# Altium schematic sheet 5V_12V_Converter.SchDoc
size B; SheetNumber: 3; SheetTotal: 8
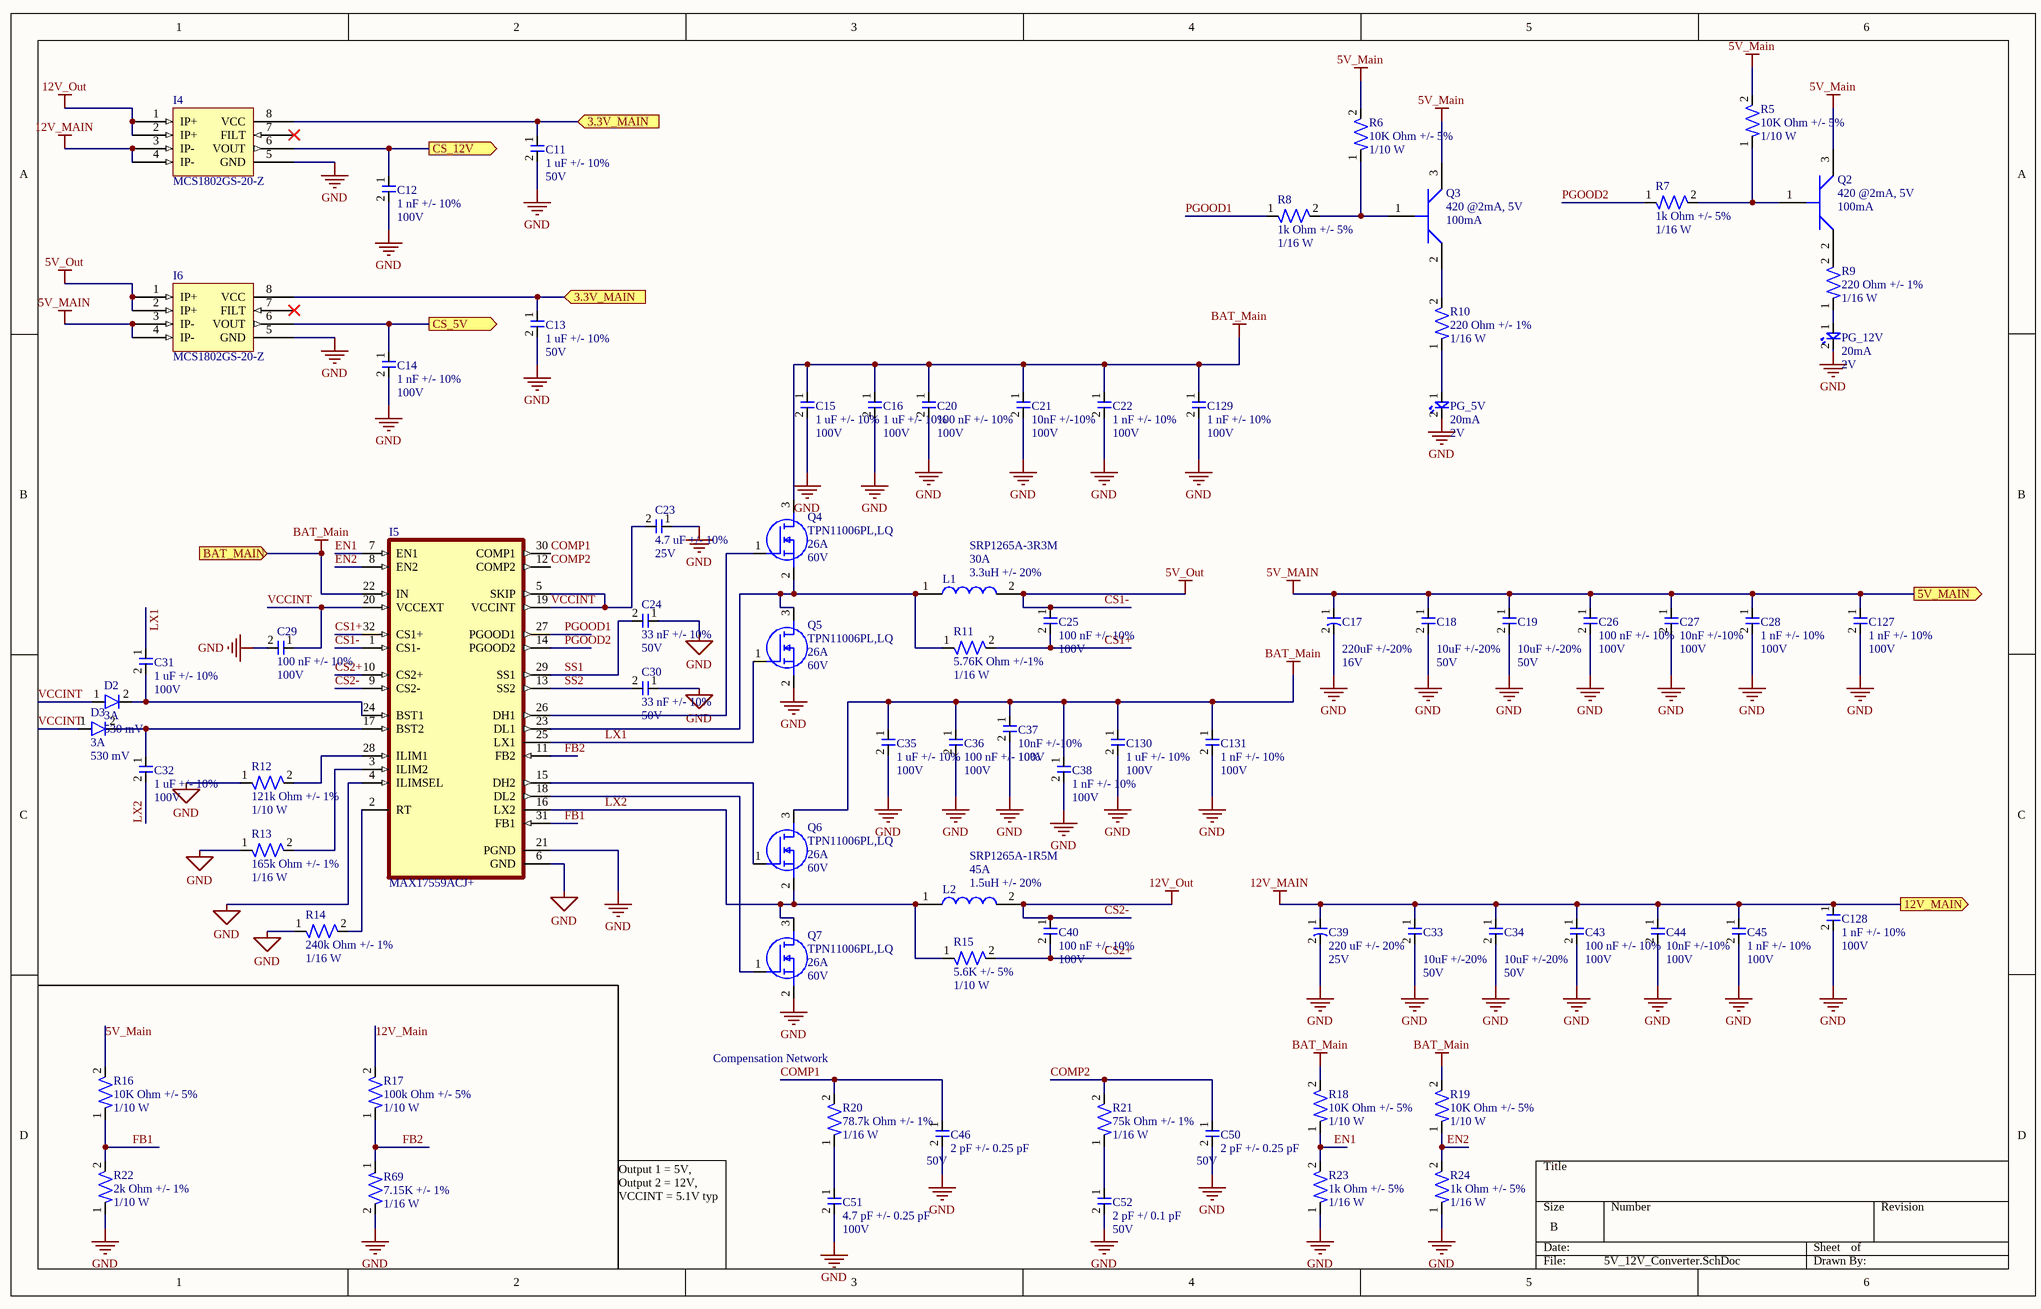
[diagram p0: 5V_12V_Converter.SchDoc]

## Parts
C11  Cap: 1 uF +/- 10%  Voltage: 50V  [CAP-0805]  (hidden comment: GCM21BR71H105KA03L)
C12  Capacitance: 1 nF +/- 10%  Voltage: 100V  [CAP-0402]  (hidden comment: C0402C102K1GECAUTO)
C13  Cap: 1 uF +/- 10%  Voltage: 50V  [CAP-0805]  (hidden comment: GCM21BR71H105KA03L)
C14  Capacitance: 1 nF +/- 10%  Voltage: 100V  [CAP-0402]  (hidden comment: C0402C102K1GECAUTO)
C15  Capacitance: 1 uF +/- 10%  Voltage: 100V  [CAP-1206 - duplicate]  (hidden comment: C1206X105K101T)
C16  Capacitance: 1 uF +/- 10%  Voltage: 100V  [CAP-1206 - duplicate]  (hidden comment: C1206X105K101T)
C17  Capacitance: 220uF +/-20%  Voltage Rating: 16V  [ELEC-220U-0001]  (hidden comment: UUD1C221MCL1GS)
C18  Capacitance: 10uF +/-20%  Voltage Rating: 50V  [CAP-1206]  (hidden comment: CL31B106KBHNNNE)
C19  Capacitance: 10uF +/-20%  Voltage Rating: 50V  [CAP-1206]  (hidden comment: CL31B106KBHNNNE)
C20  Capacitance: 100 nF +/- 10%  Voltage: 100V  [CAP-0603]  (hidden comment: CC0603KRX7R0BB104)
C21  Capacitance: 10nF +/-10%  Voltage Rating: 100V  [CAP-0603]  (hidden comment: CC0603KRX7R0BB103)
C22  Capacitance: 1 nF +/- 10%  Voltage: 100V  [CAP-0402]  (hidden comment: C0402C102K1GECAUTO)
C23  Capacitacen: 4.7 uF +/- 10%  Voltage: 25V  [CAP-0603]  (hidden comment: CC0603KRX5R8BB475)
C24  Capacitance: 33 nF +/- 10%  Voltage: 50V  [CAP-0402]  (hidden comment: GRM155R71H333KE14D)
C25  Capacitance: 100 nF +/- 10%  Voltage: 100V  [CAP-0603]  (hidden comment: CC0603KRX7R0BB104)
C26  Capacitance: 100 nF +/- 10%  Voltage: 100V  [CAP-0603]  (hidden comment: CC0603KRX7R0BB104)
C27  Capacitance: 10nF +/-10%  Voltage Rating: 100V  [CAP-0603]  (hidden comment: CC0603KRX7R0BB103)
C28  Capacitance: 1 nF +/- 10%  Voltage: 100V  [CAP-0402]  (hidden comment: C0402C102K1GECAUTO)
C29  Capacitance: 100 nF +/- 10%  Voltage: 100V  [CAP-0603]  (hidden comment: CC0603KRX7R0BB104)
C30  Capacitance: 33 nF +/- 10%  Voltage: 50V  [CAP-0402]  (hidden comment: GRM155R71H333KE14D)
C31  Capacitance: 1 uF +/- 10%  Voltage: 100V  [CAP-1206 - duplicate]  (hidden comment: CL31B105KCHNNNE)
C32  Capacitance: 1 uF +/- 10%  Voltage: 100V  [CAP-1206 - duplicate]  (hidden comment: CL31B105KCHNNNE)
C33  Capacitance: 10uF +/-20%  Voltage Rating: 50V  [CAP-1206]  (hidden comment: CL31B106KBHNNNE)
C34  Capacitance: 10uF +/-20%  Voltage Rating: 50V  [CAP-1206]  (hidden comment: CL31B106KBHNNNE)
C35  Capacitance: 1 uF +/- 10%  Voltage: 100V  [CAP-1206 - duplicate]  (hidden comment: C1206X105K101T)
C36  Capacitance: 100 nF +/- 10%  Voltage: 100V  [CAP-0603]  (hidden comment: CC0603KRX7R0BB104)
C37  Capacitance: 10nF +/-10%  Voltage Rating: 100V  [CAP-0603]  (hidden comment: CC0603KRX7R0BB103)
C38  Capacitance: 1 nF +/- 10%  Voltage: 100V  [CAP-0402]  (hidden comment: C0402C102K1GECAUTO)
C39  Capacitance: 220 uF +/- 20%  Voltage: 25V  [ELEC-220U-0002]  (hidden comment: 25THV220M8X10.5)
C40  Capacitance: 100 nF +/- 10%  Voltage: 100V  [CAP-0603]  (hidden comment: CC0603KRX7R0BB104)
C43  Capacitance: 100 nF +/- 10%  Voltage: 100V  [CAP-0603]  (hidden comment: CC0603KRX7R0BB104)
C44  Capacitance: 10nF +/-10%  Voltage Rating: 100V  [CAP-0603]  (hidden comment: CC0603KRX7R0BB103)
C45  Capacitance: 1 nF +/- 10%  Voltage: 100V  [CAP-0402]  (hidden comment: C0402C102K1GECAUTO)
C46  Cap: 2 pF +/- 0.25 pF  Voltage: 50V  [CAP-0402]  (hidden comment: GJM1555C1H2R0CB01D)
C50  Cap: 2 pF +/- 0.25 pF  Voltage: 50V  [CAP-0402]  (hidden comment: GJM1555C1H2R0CB01D)
C51  capacitance: 4.7 pF +/- 0.25 pF  Voltage: 100V  [CAP-0603]  (hidden comment: CC0603CRNPO0BN4R7)
C52  Capacitance: 2 pF +/ 0.1 pF  Voltage: 50V  [CAP-0402]  (hidden comment: CC0402BRNPO9BN3R0)
C127  Capacitance: 1 nF +/- 10%  Voltage: 100V  [CAP-0402]  (hidden comment: C0402C102K1GECAUTO)
C128  Capacitance: 1 nF +/- 10%  Voltage: 100V  [CAP-0402]  (hidden comment: C0402C102K1GECAUTO)
C129  Capacitance: 1 nF +/- 10%  Voltage: 100V  [CAP-0402]  (hidden comment: C0402C102K1GECAUTO)
C130  Capacitance: 1 uF +/- 10%  Voltage: 100V  [CAP-1206 - duplicate]  (hidden comment: C1206X105K101T)
C131  Capacitance: 1 nF +/- 10%  Voltage: 100V  [CAP-0402]  (hidden comment: C0402C102K1GECAUTO)
D2  Current Rating: 3A  Vf (Voltage Forward): 530 mV  [DIO-SOD128]  (hidden comment: PMEG6030EP,115)
D3  Current Rating: 3A  Vf (Voltage Forward): 530 mV  [DIO-SOD128]  (hidden comment: PMEG6030EP,115)
I4  MCS1802GS-20-Z  [IC-BUCK-8SOIC]
I5  MAX17559ACJ+  [IC-BUCK-TQFP-7x7]
I6  MCS1802GS-20-Z  [IC-BUCK-8SOIC]
L1  SRP1265A-3R3M  Saturation Current: 30A  Inductance: 3.3uH +/- 20%  [PWRIND-3.3U-0002]
L2  SRP1265A-1R5M  Saturation Current: 45A  Inductance: 1.5uH +/- 20%  [PWRIND-1.5U-0002]
PG_5V  Current Rating: 20mA  Vf: 2V  [LED-0603]  (hidden comment: 150060AS75000)
PG_12V  Current Rating: 20mA  Vf: 2V  [LED-0603]  (hidden comment: 150060AS75000)
Q2  hFE: 420 @2mA, 5V  Ic: 100mA  [NPN-420-0001]  (hidden comment: BC847C,235)
Q3  hFE: 420 @2mA, 5V  Ic: 100mA  [NPN-420-0001]  (hidden comment: BC847C,235)
Q4  TPN11006PL,LQ  Id-Continuous: 26A  VDS-Max: 60V  [NMOS-8TSON]
Q5  TPN11006PL,LQ  Id-Continuous: 26A  VDS-Max: 60V  [NMOS-8TSON]
Q6  TPN11006PL,LQ  Id-Continuous: 26A  VDS-Max: 60V  [NMOS-8TSON]
Q7  TPN11006PL,LQ  Id-Continuous: 26A  VDS-Max: 60V  [NMOS-8TSON]
R5  Resistance: 10K Ohm +/- 5%  Power: 1/10 W  [RES-0402]  (hidden comment: ERJ2GEJ103X)
R6  Resistance: 10K Ohm +/- 5%  Power: 1/10 W  [RES-0402]  (hidden comment: ERJ2GEJ103X)
R7  Resistance: 1k Ohm +/- 5%  Power: 1/16 W  [RES-0402]  (hidden comment: RC0402FR-071KL)
R8  Resistance: 1k Ohm +/- 5%  Power: 1/16 W  [RES-0402]  (hidden comment: RC0402FR-071KL)
R9  Resistance: 220 Ohm +/- 1%  Power: 1/16 W  [RES-0402]  (hidden comment: RM04FTN2200)
R10  Resistance: 220 Ohm +/- 1%  Power: 1/16 W  [RES-0402]  (hidden comment: RM04FTN2200)
R11  Resistance: 5.76K Ohm +/-1%  Power: 1/16 W  [RES-0402]  (hidden comment: RTT025761FTH)
R12  Resistance: 121k Ohm +/- 1%  Power: 1/10 W  [RES-0402]  (hidden comment: RMC10K1213FTH)
R13  Resistance: 165k Ohm +/- 1%  Power: 1/16 W  [RES-0402]  (hidden comment: RC0402FR-07165KL)
R14  Resistance: 240k Ohm +/- 1%  Power: 1/16 W  [RES-0402]  (hidden comment: 0402WGF2403TCE)
R15  Resistance: 5.6K +/- 5%  Power: 1/10 W  [RES-0402]  (hidden comment: ERJ2GEJ472X)
R16  Resistance: 10K Ohm +/- 5%  Power: 1/10 W  [RES-0402]  (hidden comment: ERJ2GEJ103X)
R17  Resistance: 100k Ohm +/- 5%  Power: 1/10 W  [RES-0402]  (hidden comment: ERJ2GEJ104X)
R18  Resistance: 10K Ohm +/- 5%  Power: 1/10 W  [RES-0402]  (hidden comment: ERJ2GEJ103X)
R19  Resistance: 10K Ohm +/- 5%  Power: 1/10 W  [RES-0402]  (hidden comment: ERJ2GEJ103X)
R20  Resistance: 78.7k Ohm +/- 1%  Power: 1/16 W  [RES-0402]  (hidden comment: RC0402FR-0778K7L)
R21  Resistance: 75k Ohm +/- 1%  Power: 1/16 W  [RES-0402]  (hidden comment: CR0402FF7502G)
R22  Resistance: 2k Ohm +/- 1%  Parameter 2: 1/10 W  [RES-0402]  (hidden comment: ERJ2RKF2001X)
R23  Resistance: 1k Ohm +/- 5%  Power: 1/16 W  [RES-0402]  (hidden comment: RC0402FR-071KL)
R24  Resistance: 1k Ohm +/- 5%  Power: 1/16 W  [RES-0402]  (hidden comment: RC0402FR-071KL)
R69  Resistance: 7.15K +/- 1%  Power: 1/16 W  [RES-0402]  (hidden comment: CRCW04027K15FKED)

## Ports
3.3V_MAIN (in), 5V_MAIN (out), 12V_MAIN (out), BAT_MAIN (in), CS_5V (out), CS_12V (out)

## Nets
5V_Main: C17.1 C18.1 C19.1 C26.1 C27.1 C28.1 C127.1 I6.3(IP-) I6.4(IP-) Q2.3 Q3.3 R5.2 R6.2 R16.2 ; port 5V_MAIN
12V_Main: C33.1 C34.1 C39.1 C43.1 C44.1 C45.1 C128.1 I4.3(IP-) I4.4(IP-) R17.2 ; port 12V_MAIN
BAT_Main: C15.1 C16.1 C20.1 C21.1 C22.1 C35.1 C36.1 C37.1 C38.1 C129.1 C130.1 C131.1 I5.22(IN) Q4.3(D) Q6.3(D) R18.2 R19.2 ; port BAT_MAIN
CS1-: C25.1 I5.1(CS1-) I6.1(IP+) I6.2(IP+) L1.2  [also labelled 5V_Out]
CS2-: C40.1 I4.1(IP+) I4.2(IP+) I5.9(CS2-) L2.2  [also labelled 12V_Out]
GND: C11.2 C12.2 C13.2 C14.2 C15.2 C16.2 C17.2 C18.2 C19.2 C20.2 C21.2 C22.2 C23.1 C24.1 C26.2 C27.2 C28.2 C29.2 C30.1 C33.2 C34.2 C35.2 C36.2 C37.2 C38.2 C39.2 C43.2 C44.2 C45.2 C46.2 C50.2 C51.2 C52.2 C127.2 C128.2 C129.2 C130.2 C131.2 I4.5(GND) I5.4(ILIMSEL) I5.6(GND) I5.21(PGND) I6.5(GND) PG_5V.2 PG_12V.2 Q5.2(S) Q7.2(S) R12.1 R13.1 R14.1 R22.1 R23.1 R24.1 R69.2
3.3V_MAIN: C11.1 C13.1 I4.8(VCC) I6.8(VCC) ; port 3.3V_MAIN
COMP1: C46.1 I5.30(COMP1) R20.2
COMP2: C50.1 I5.12(COMP2) R21.2
CS1+: C25.2 I5.32(CS1+) R11.2
CS2+: C40.2 I5.10(CS2+) R15.2
CS_5V: C14.1 I6.6(VOUT) ; port CS_5V
CS_12V: C12.1 I4.6(VOUT) ; port CS_12V
EN1: I5.7(EN1) R18.1 R23.2
EN2: I5.8(EN2) R19.1 R24.2
FB1: I5.31(FB1) R16.1 R22.2
FB2: I5.11(FB2) R17.1 R69.1
LX1: C31.1 I5.25(LX1) Q5.1(G)
LX2: C32.2 I5.16(LX2) L2.1 Q6.2(S) Q7.3(D) R15.1
PGOOD1: I5.27(PGOOD1) R8.1
PGOOD2: I5.14(PGOOD2) R7.1
SS1: C24.2 I5.29(SS1)
SS2: C30.2 I5.13(SS2)
VCCINT: C23.2 C29.1 D2.1 D3.1 I5.5(SKIP) I5.19(VCCINT) I5.20(VCCEXT)
NetC31_2: C31.2 D2.2 I5.24(BST1)
NetC32_1: C32.1 D3.2 I5.17(BST2)
NetC51_1: C51.1 R20.1
NetC52_1: C52.1 R21.1
NetI5_2: I5.2(RT) R14.2
NetI5_3: I5.3(ILIM2) R13.2
NetI5_15: I5.15(DH2) Q6.1(G)
NetI5_18: I5.18(DL2) Q7.1(G)
NetI5_23: I5.23(DL1) L1.1 Q4.2(S) Q5.3(D) R11.1
NetI5_26: I5.26(DH1) Q4.1(G)
NetI5_28: I5.28(ILIM1) R12.2
NetPG_5V_1: PG_5V.1 R10.1
NetPG_12V_1: PG_12V.1 R9.1
NetQ2_1: Q2.1 R5.1 R7.2
NetQ2_2: Q2.2 R9.2
NetQ3_1: Q3.1 R6.1 R8.2
NetQ3_2: Q3.2 R10.2

Not connected (* = marked no-connect by the designer): I4 7(FILT)*; I6 7(FILT)*

## Notes on the sheet
- (near R20) Compensation Network
- Output 1 = 5V,   Output 2 = 12V, VCCINT = 5.1V typ

## Library data of the parts
C11 C13 = CAP-1U-0003-JLC: 50V 1uF X7R ±10% 0805 Multilayer Ceramic Capacitors MLCC - SMD/SMT ROHS; assembled?: yes; JLC Part Number: C126592
C12 C14 C22 C28 C38 C45 C127-C129 C131 = CAP-1N-0004-JLC: 100V 1nF C0G ±10% 0402 Multilayer Ceramic Capacitors MLCC - SMD/SMT ROHS; assembled?: yes; JLC part number: C696348
C15 C16 C35 C130 = CAP-1U-0004-JLC: 100V 1uF X7R ±10% 1206 Multilayer Ceramic Capacitors MLCC - SMD/SMT ROHS; assembled: yes; JLC Part Number: C106026
C17 = ELEC-220U-0001: 220 µF 16 V Aluminum Electrolytic Capacitors Radial, Can - SMD 2000 Hrs @ 105°C; Manufacturer: Nichicon; Assembled?: no; Manufacturer Part Number: UUD1C221MCL1GS
C18 C19 C33 C34 = CAP-10U-0001: 10 µF ±10% 50V Ceramic Capacitor X7R 1206 (3216 Metric); Manufacturer: Samsung Electro-Mechanics; Assembled?: no; Manufacturer Part Number: CL31B106KBHNNNE; Temperature Coefficient: X7R; Package Size: 1206
C20 C25 C26 C29 C36 C40 C43 = CAP-100N-0002-JLC: 100V 100nF X7R ±10% 0603 Multilayer Ceramic Capacitors MLCC - SMD/SMT ROHS; assembled?: yes; JLC Part Number: C113803
C21 C27 C37 C44 = CAP-10N-0003-JLC: 100V 10nF X7R ±10% 0603 Multilayer Ceramic Capacitors MLCC - SMD/SMT ROHS; Manufacturer: Yageo; Assembled?: yes; Manufacturer Part Number: CC0603KRX7R0BB103; Temperature Coefficient: X7R; Package Size: 0603; JLC Part Number: C107059
C23 = CAP-4.7U-0002-JLC: 25V 4.7uF X5R ±10% 0603 Multilayer Ceramic Capacitors MLCC - SMD/SMT ROHS; assembled: yes; JLC part number: C326580
C24 C30 = CAP-33N-0002-JLC: 50V 33nF X7R ±10% 0402  Multilayer Ceramic Capacitors MLCC - SMD/SMT ROHS; assembled?: yes; JLC part number: C415530
C31 C32 = CAP-1U-0001: 1 µF ±10% 100V Ceramic Capacitor X7R 1206 (3216 Metric)
C39 = ELEC-220U-0002: 220 µF 25 V Aluminum Electrolytic Capacitors Radial, Can - SMD 300mOhm @ 100kHz 3000 Hrs @ 125°C; SIze: 0.327 in x 0.327 in
C46 C50 = CAP-2P-0002-JLC: 50V 2pF C0G ±0.25pF 0402 Multilayer Ceramic Capacitors MLCC - SMD/SMT ROHS; assembled: yes; JLC part number: C85879
C51 = CAP-4.7P-0003-JLC: 100V 4.7pF NP0 ±0.25pF 0603 Multilayer Ceramic Capacitors MLCC - SMD/SMT ROHS; assembled: yes; JLC part number: C527037
C52 = CAP-3P-0001-JLC: 50V 3pF NP0 ±0.1pF 0402 Multilayer Ceramic Capacitors MLCC - SMD/SMT ROHS; assembled: yes; JLC Part Number: C327228
D2 D3 = DIO-0.53V-0001: Diode Schottky 60 V 3A Surface Mount SOD-128/CFP5; Manufacturer: Nexperia USA Inc.; Assembled: no; Manufacturer Part Number: PMEG6030EP,115; Package: SOD-128/CFP5
I4 I6 = IC-CURRENT-0002: Current Sensor ±20A 1 Channel Hall Effect Bidirectional 8-SOIC (0.154", 3.90mm Width); Manufacturer Part Number: MCS1802GS-20-Z
I5 = IC-BUCK-0005: Buck Regulator Positive Output Step-Down - DC-DC Controller IC 32-TQFP (7x7); MF: Maxim Integrated; SnapEDA_Link: https://www.snapeda.com/parts/MAX17559ACJ+/Maxim+Integrated/view-part/?ref=snap; MP: MAX17559ACJ+; Package: TQFP-32 Maxim; Check_prices: https://www.snapeda.com/parts/MAX17559ACJ+/Maxim+Integrated/view-part/?ref=eda; Value: *; Purchase-URL: https://pricing.snapeda.com/search/part/MAX17559ACJ+/?ref=eda; Digi-Key_Part_Number: MAX17559ACJ+T-ND
L1 = PWRIND-3.3U-0002: 3.3 µH Shielded Drum Core, Wirewound Inductor 18 A 6.8mOhm Max Nonstandard; Manufacturer: Bourns Electronics; Type: DEV; Copyright: Copyright (C) 2022 Ultra Librarian. All rights reserved.; Manufacturer Part Number: SRP1265A-3R3M; Dimensions: 12.5x13.5x6.2; DC Resistance: 6.8mOhm max
L2 = PWRIND-1.5U-0002: 1.5 µH Shielded Drum Core, Wirewound Inductor 27 A 3mOhm Max Nonstandard; Manufacturer: Bourns Electronics; Type: DEV; DC Resistnace: 3.0mOhm max; Copyright: Copyright (C) 2022 Ultra Librarian. All rights reserved.; Manufacturer Part Number: SRP1265A-1R5M; Dimensions: 12.5x13.5x6.2
PG_5V PG_12V = LED_Amber_0001: CAP CER 0.1UF 100V X7R 0603; Manufacturer: Wurth Electronik; Assembled?: no; Manufacturer Part Number: 150060AS75000; Package Size: 0603; Color: Amber
Q2 Q3 = BJT-420-0001: Bipolar (BJT) Transistor NPN 45 V 100 mA 100MHz 250 mW Surface Mount TO-236AB; VCEO: 45V; Transistor type: NPN; Package: TO-236AB
Q4-Q7 = NMOS-26A-0001: N-Channel 60 V 26A (Tc) 610mW (Ta), 61W (Tc) Surface Mount 8-TSON Advance (3.1x3.1); Manufacturer: Toshiba; Rds On-Max: 18.1mOhm; Vgs-Max: 20V; Assembled?: no; Manufacturer Part Number: TPN11006PL,LQ; FET type: N-Channel; Package: 8-TSON Advance
R5 R6 R16 R18 R19 = RES-10K-0003-JLC: 100mW Thick Film Resistors 100V ±5% ±200ppm/℃ -55℃~+155℃ 10kΩ 0402  Chip Resistor - Surface Mount ROHS; assembled?: yes; JLC part number: C278577
R7 R8 R23 R24 = RES-1K-0003-JLC: 62.5mW Thick Film Resistors 50V ±100ppm/℃ ±1% -55℃~+155℃ 1kΩ 0402 Chip Resistor - Surface Mount ROHS; assembled?: yes; JLC Part Number: C106235
R9 R10 = RES-220-0002-JLC: 62.5mW Thick Film Resistors 50V ±100ppm/℃ ±1% -55℃~+155℃ 220Ω 0402  Chip Resistor - Surface Mount ROHS; assembled?: yes; JLC part number: C160487
R11 = RES-5.76K-0002-JLC: 62.5mW Thick Film Resistors 50V ±100ppm/℃ ±1% -55℃~+155℃ 5.76kΩ 0402  Chip Resistor - Surface Mount ROHS; assembled?: yes; JLC part number: C11590
R12 = RES-121K-0002-JLC: 100mW ±100ppm/℃ ±1% 121kΩ 0402  Chip Resistor - Surface Mount ROHS; assembled?: yes; JLC part number: C323687
R13 = RES-165K-0002-JLC: 62.5mW Thick Film Resistors 50V ±100ppm/℃ ±1% -55℃~+155℃ 165kΩ 0402  Chip Resistor - Surface Mount ROHS; assembled?: yes; JLC part number: C327368
R14 = RES-240K-0002-JLC: 62.5mW Thick Film Resistors 50V ±100ppm/℃ ±1% -55℃~+155℃ 240kΩ 0402  Chip Resistor - Surface Mount ROHS; assembled?: yes; JLC part number: C64043
R15 = RES-5.6K-0002-JLC: 100mW Thick Film Resistors ±5% ±200ppm/℃ -55℃~+155℃ 4.7kΩ 0402  Chip Resistor - Surface Mount ROHS; assembled?: yes; JLC part number: C413001
R17 = RES-100K-0002-JLC: 100mW Thick Film Resistors ±5% ±200ppm/℃ -55℃~+155℃ 100kΩ 0402  Chip Resistor - Surface Mount ROHS; assembled?: yes; JLC part number: C413017
R20 = RES-78.7K-0002-JLC: 62.5mW 50V ±100ppm/℃ ±1% -55℃~+155℃ 78.7kΩ 0402  Chip Resistor - Surface Mount ROHS; assembled?: yes; JLC part number: C163454
R21 = RES-75K-0002-JLC: 62.5mW Thick Film Resistors 50V ±1% ±200ppm/℃ -55℃~+125℃ 75kΩ 0402  Chip Resistor - Surface Mount ROHS; assembled?: yes; JLC part number: C100527
R22 = RES-2K-0002-JLC: 100mW Thick Film Resistors 100V ±100ppm/℃ ±1% -55℃~+155℃ 2kΩ 0402  Chip Resistor - Surface Mount ROHS; assembled?: yes; JLC part number: C413086
R69 = RES-7K-0001: 7.15 kOhms ±1% 0.063W, 1/16W Chip Resistor 0402 (1005 Metric) Automotive AEC-Q200 Thick Film